# Altium schematic sheet esp32.SchDoc
size A4
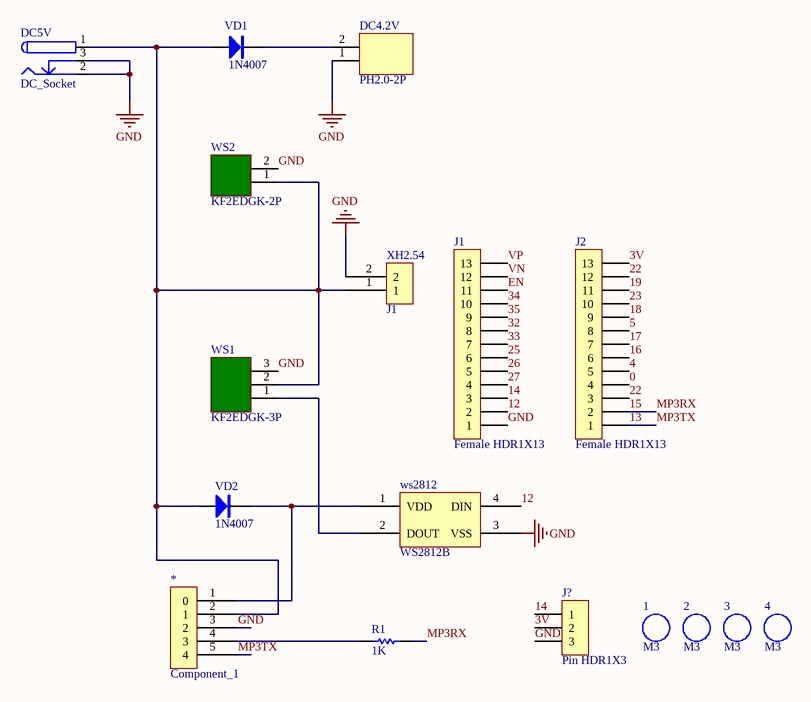
[diagram p0: esp32.SchDoc]

## Parts
1  M3  [M3 125X200]
2  M3  [M3 125X200]
3  M3  [M3 125X200]
4  M3  [M3 125X200]
*  Component_1  [XH2.54-WS-5P]
DC4.2V  PH2.0-2P  [PH2.0WS-2P]
DC5V  DC_Socket  [DC-005]
J1  Female HDR1X13  [Fe-HDR1X13/2.54-S]
J2  Female HDR1X13  [Fe-HDR1X13/2.54-S]
J?  Pin HDR1X3  [Pin HDR1X3/2.54mm-W]
R1  1K  [0603R]
VD1  1N4007  [SMA]
VD2  1N4007  [SMA]
WS1  KF2EDGK-3P  [KF2EDGK5.0W-3P]
WS2  KF2EDGK-2P  [KF2EDGK5.08W-2P]
ws2812  WS2812B  [WS2812B]
XH2.54  J1  [XH2.54-WS-2P]

## Nets
GND: *.3(2) DC4.2V.1 DC5V.2 DC5V.3 J1.1 J?.3 WS1.3 WS2.2 ws2812.3(VSS) XH2.54.2
0: J2.4
3V: J2.13 J?.2
4: J2.5
5: J2.8
12: J1.2 ws2812.4(DIN)
13: *.5(4) J2.1  [also labelled MP3TX]
14: J1.3 J?.1
15: J2.2 R1.1  [also labelled MP3RX]
16: J2.6
17: J2.7
18: J2.9
19: J2.11
22: J2.3 J2.12
23: J2.10
25: J1.6
26: J1.5
27: J1.4
32: J1.8
33: J1.7
34: J1.10
35: J1.9
EN: J1.11
VN: J1.12
VP: J1.13
Net*_1: *.1(0) VD2.2(K) ws2812.1(VDD)
Net*_2: *.2(1) DC5V.1 VD1.1(A) VD2.1(A) WS1.2 WS2.1 XH2.54.1
Net*_4: *.4(3) R1.2
NetDC4.2V_2: DC4.2V.2 VD1.2(K)
NetWS1_1: WS1.1 ws2812.2(DOUT)

## Library data of the parts
1-4 = M3: 铜柱孔; 版权归属: 源创客; BOM名称: 铜柱孔; 学习资源: www.ooocke.com
R1 = RES
VD1 VD2 = 1N4007: 整流二极管; 版权归属: 源创客; BOM名称: 整流二极管; 学习资源: www.ooocke.com
XH2.54 = XH2.54